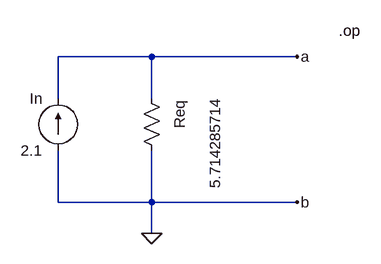
[diagram p0: schematic Norton.asc]
Norton.asc, the LTspice schematic file:
Version 4
SHEET 1 880 680
WIRE 160 32 16 32
WIRE 384 32 160 32
WIRE 16 96 16 32
WIRE 160 96 160 32
WIRE 16 256 16 176
WIRE 160 256 160 176
WIRE 160 256 16 256
WIRE 384 256 160 256
WIRE 160 304 160 256
FLAG 384 32 a
FLAG 384 256 b
FLAG 160 304 0
SYMBOL current 16 176 R180
WINDOW 0 24 80 Left 2
WINDOW 3 24 0 Left 2
SYMATTR InstName In
SYMATTR Value 2.1
SYMBOL res 144 80 R0
WINDOW 0 59 63 VLeft 2
WINDOW 3 114 155 VLeft 2
SYMATTR InstName Req
SYMATTR Value 5.714285714
TEXT 448 -8 Left 2 !.op

The netlist it stands for:
* Norton.asc
In 0 a 2.1
Req a 0 5.714285714
.op
.backanno
.end

* Results of the author's LTspice run, read from the files saved beside the schematic
* Operating Point:
*   V(a) = 12 V
*   I(In) = 2.1 A
*   I(Req) = 2.1 A